# EAGLE schematic 20A DC Motor Controller with SLAVE OUT v12 (EAGLE 9.3.2)
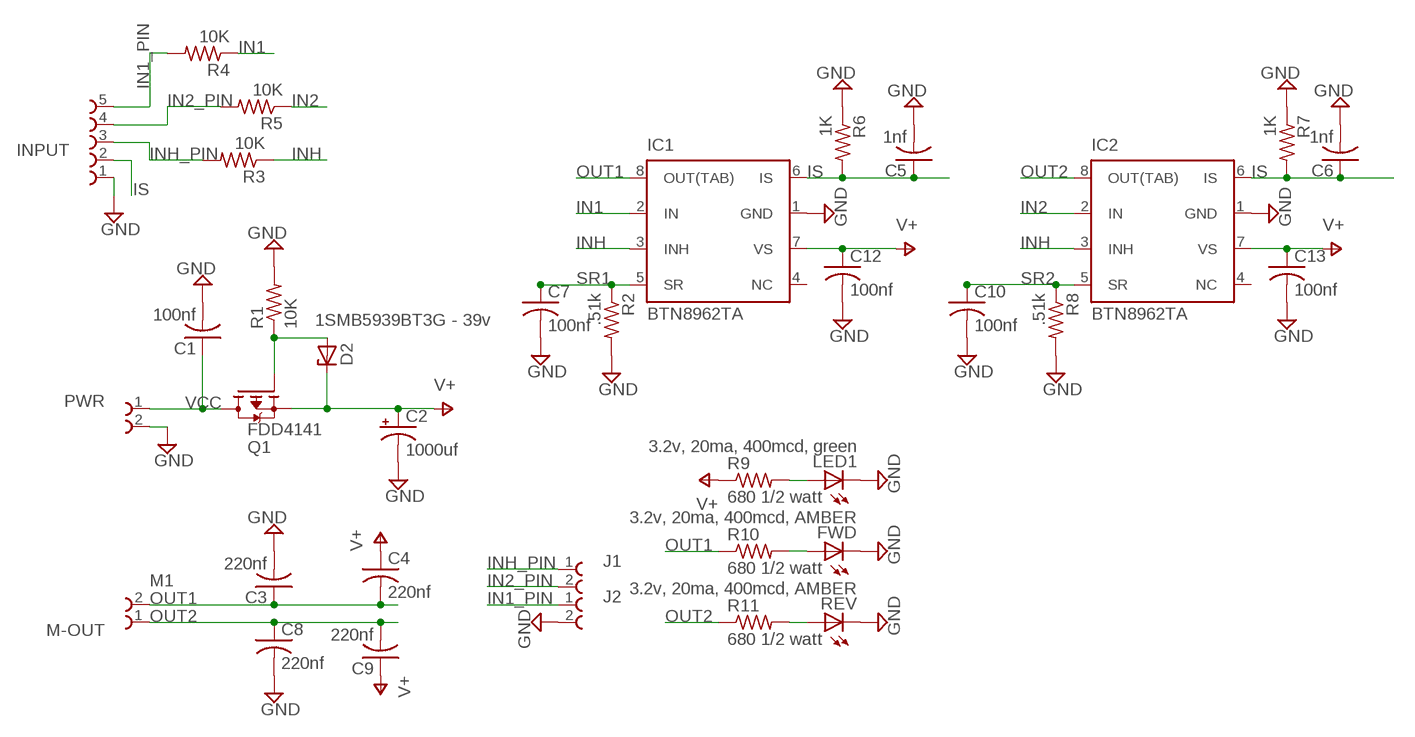
[diagram p0: schematic, sheet 1]

## Parts
C1  100nf  C-USC0805  [C0805]
C2  1000uf  CPOL-USTT5D10  [TT5D10]
C3  220nf  C-USC0805  [C0805]
C4  220nf  C-USC0805  [C0805]
C5  1nf  C-USC0805  [C0805]
C6  1nf  C-USC0805  [C0805]
C7  100nf  C-USC0805  [C0805]
C8  220nf  C-USC0805  [C0805]
C9  220nf  C-USC0805  [C0805]
C10  100nf  C-USC0805  [C0805]
C12  100nf  C-USC0805  [C0805]
C13  100nf  C-USC0805  [C0805]
D2  1SMB5939BT3G - 39v  ZENER-DIODESMB  [SMB]
FWD  3.2v, 20ma, 400mcd, AMBER  LEDCHIPLED_0805  [CHIPLED_0805]
IC1  BTN8962TA  [P-TO263-7-1_LG_PADS]
IC2  BTN8962TA  [P-TO263-7-1_LG_PADS]
INPUT  691311500105  [691311500105]
J1  WURTH_ELEKTRONIK_ELECTROMECHANIC_TERMINAL_BLOCKS_CONNECTORS_REV16E_691214110002  [WURTH_ELEKTRONIK_ELECTROMECHANIC_TERMINAL_BLOCKS_CONNECTORS_REV16E_691214110002]
J2  WURTH_ELEKTRONIK_ELECTROMECHANIC_TERMINAL_BLOCKS_CONNECTORS_REV16E_691214110002  [WURTH_ELEKTRONIK_ELECTROMECHANIC_TERMINAL_BLOCKS_CONNECTORS_REV16E_691214110002]
LED1  3.2v, 20ma, 400mcd, green  LEDCHIPLED_0805  [CHIPLED_0805]
M-OUT  TERMINAL BLOCK 7.50MM VERT 2POS, ED110/2DS  7-5MM-SCREW-TERM  [7-5MM-SCREW-TERM]
PWR  TERMINAL BLOCK 7.50MM VERT 2POS, ED110/2DS  7-5MM-SCREW-TERM  [7-5MM-SCREW-TERM]
Q1  FDD4141  FDD4141TO252  [TO252]
R1  10K  R-US_R0805  [R0805]
R2  .51k  R-US_R0805  [R0805]
R3  10K  R-US_R0805  [R0805]
R4  10K  R-US_R0805  [R0805]
R5  10K  R-US_R0805  [R0805]
R6  1K  R-US_R0805  [R0805]
R7  1K  R-US_R0805  [R0805]
R8  .51k  R-US_R0805  [R0805]
R9  680 1/2 watt  R-US_R0805  [R0805]
R10  680 1/2 watt  R-US_R0805  [R0805]
R11  680 1/2 watt  R-US_R0805  [R0805]
REV  3.2v, 20ma, 400mcd, AMBER  LEDCHIPLED_0805  [CHIPLED_0805]

## Nets
GND [GND]: C1.2 C2.- C3.2 C5.2 C6.2 C7.2 C8.2 C10.2 C12.2 C13.2 FWD.C IC1.1(GND) IC2.1(GND) INPUT.1 J2.2 LED1.C PWR.2 R1.2 R2.2 R6.1 R7.1 R8.2 REV.C
IN1: IC1.2(IN) R4.1
IN1_PIN: INPUT.5 J2.1 R4.2
IN2: IC2.2(IN) R5.1
IN2_PIN: INPUT.4 J1.2 R5.2
INH: IC1.3(INH) IC2.3(INH) R3.1
INH_PIN: INPUT.3 J1.1 R3.2
IS: C5.1 C6.1 IC1.6(IS) IC2.6(IS) INPUT.2 R6.2 R7.2
N$1: LED1.A R9.2
N$2: FWD.A R10.2
N$3: R11.2 REV.A
OUT1 [PWR]: C3.1 C4.2 IC1.8(OUT(TAB)) M-OUT.2 R10.1
OUT2 [PWR]: C8.1 C9.2 IC2.8(OUT(TAB)) M-OUT.1 R11.1
Q1_GATE: D2.A Q1.1(G) R1.1
SR1: C7.1 IC1.5(SR) R2.1
SR2: C10.1 IC2.5(SR) R8.1
V+: C2.+ C4.1 C9.1 C12.1 C13.1 D2.C IC1.7(VS) IC2.7(VS) Q1.2(S) R9.1
VCC: C1.1 PWR.1 Q1.3(D)
Unconnected: IC1.4(NC) IC2.4(NC)

## Notes on the sheet
- M1

## Library data of the parts
C1 C3-C10 C12 C13 = adafruit:C-US: CAPACITOR, American symbol
C2 = adafruit:CPOL-US: POLARIZED CAPACITOR, American symbol
D2 = diode:ZENER-DIODE: Z-Diode
FWD LED1 REV = adafruit:LED: LED OSRAM: - CHIPLED LG R971, LG N971, LY N971, LG Q971, LY Q971, LO R971, LY R971 LH N974, LH R974 LS Q976, LO Q976, LY Q976 LO Q996 - Hyper CHIPLED LW Q18S LB Q993, LB Q99A, LB R99A - SideLED LS A670, LO A670, LY A670, LG A670, LP A670 LB A673, LV A673, LT A673, LW A673 LH A674 LY A675 LS A676, LA A676, LO A676, LY A676, LW A676 LS A679, LY A679, LG A679 - Hyper Micro SIDELED® LS Y876, LA Y876, LO Y876, LY Y876 LT Y87S - SmartLED LW L88C, LW L88S LB L89C, LB L89S, LG L890 LS L89K, LO L89K, LY L89K LS L896, LA L896, LO L896, LY L896 - TOPLED LS T670, LO T670, LY T670, LG T670, LP T670 LSG T670, LSP T670, LSY T670, LOP T670, LYG T670 LG T671, LOG T671, LSG T671 LB T673, LV T673, LT T673, LW T673 LH T674 LS T676, LA T676, LO T676, LY T676, LB T676, LH T676, LSB T676, LW T676 LB T67C, LV T67C, LT T67C, LS T67K, LO T67K, LY T67K, LW E67C LS E67B, LA E67B, LO E67B, LY E67B, LB E67C, LV E67C, LT E67C LW T67C LS T679, LY T679, LG T679 LS T770, LO T770, LY T770, LG T770, LP T770 LB T773, LV T773, LT T773, LW T773 LH T774 LS E675, LA E675, LY E675, LS T675 LS T776, LA T776, LO T776, LY T776, LB T776 LHGB T686 LT T68C, LB T68C - Hyper Mini TOPLED® LB M676 - Mini TOPLED Santana® LG M470 LS M47K, LO M47K, LY M47K Source: http://www.osram.convergy.de/
IC1 IC2 = my-custom-lib:BTN8962TA: 30A Half-H-Bridge for DC-Motor Applications TO-263-7 package Digkey: https://www.digikey.com/product-detail/en/BTN8962TAAUMA1/BTN8962TAAUMA1INCT-ND/4772020 Mouser: http://www.mouser.com/Search/ProductDetail.aspx?R=BTN8962TAAUMA1virtualkey63830000virtualkey726-BTN8962TAAUMA1
INPUT = Wurth_Elektronik_Electromechanic_Terminal_Blocks_Connectors_rev16e:691311500105: WR-TBL Serie 311 - 5.08 mm Close Vertical PCB Header , 5 Pins=>Code : Con_TBL_Pluggable_5.08_PCB_THT_Simple_V_691311500105 <http://katalog.we-online.de/media/images/eican/Con_TBL_Pluggable_5.08_PCB_THT_Simple_V_6913115001xx_pf2.jpg> Details see: http://katalog.we-online.de/en/em/TBL_5_08_311_CLOSE_VERTICAL_PCB_HEADER_6913115001XX Created 2014-06-23, Karrer Zheng 2014 (C) Würth Elektronik
J1 J2 = 10-Bit RasPi-ADC-VMS_HAT v21:WURTH_ELEKTRONIK_ELECTROMECHANIC_TERMINAL_BLOCKS_CONNECTORS_REV16E_691214110002: WR-TBL Serie 2141 - 3.5mm Horizontal Entry Modular with Rising Cage Clamp - 1.3 mm2 Wires, 2 Pins=>Code : Con_TBL_Screw_RisingClamp_3.50_691214110002 <http://katalog.we-online.de/media/images/eican/Con_TBL_Screw_RisingClamp_3.50_6912141100xx_pf2.jpg> Details see: http://katalog.we-online.de/en/em/TBL_3_50_2141_HORIZONTAL_ENTRY_MODULAR_69121411000X Created 2014-06-18, Karrer Zheng 2014 (C) Würth Elektronik
M-OUT PWR = my-custom-lib:7-5MM-SCREW-TERM: On Shore Technology Inc. ED110/2DS 2-Position, 7.5mm Pitch(0.295"), 14/22AWG, 300V/20A https://www.digikey.com/product-detail/en/on-shore-technology-inc/ED110-2DS/ED1605-ND/33880
Q1 = transistor-fet:FDD4141: P-Channel PowerTrench® MOSFET Source: FDD4141.pdf
R1-R11 = rcl:R-US_: RESISTOR, American symbol

## Net classes
0 default: width 0.152 mm, drill 0.305 mm, clearance 0.254 mm
1 GND: width 0.305 mm, drill 0.305 mm, clearance 0.254 mm
2 PWR: width 0.305 mm, drill 0.305 mm, clearance 0.254 mm